# EAGLE design ft232 (EAGLE 7.4.0)
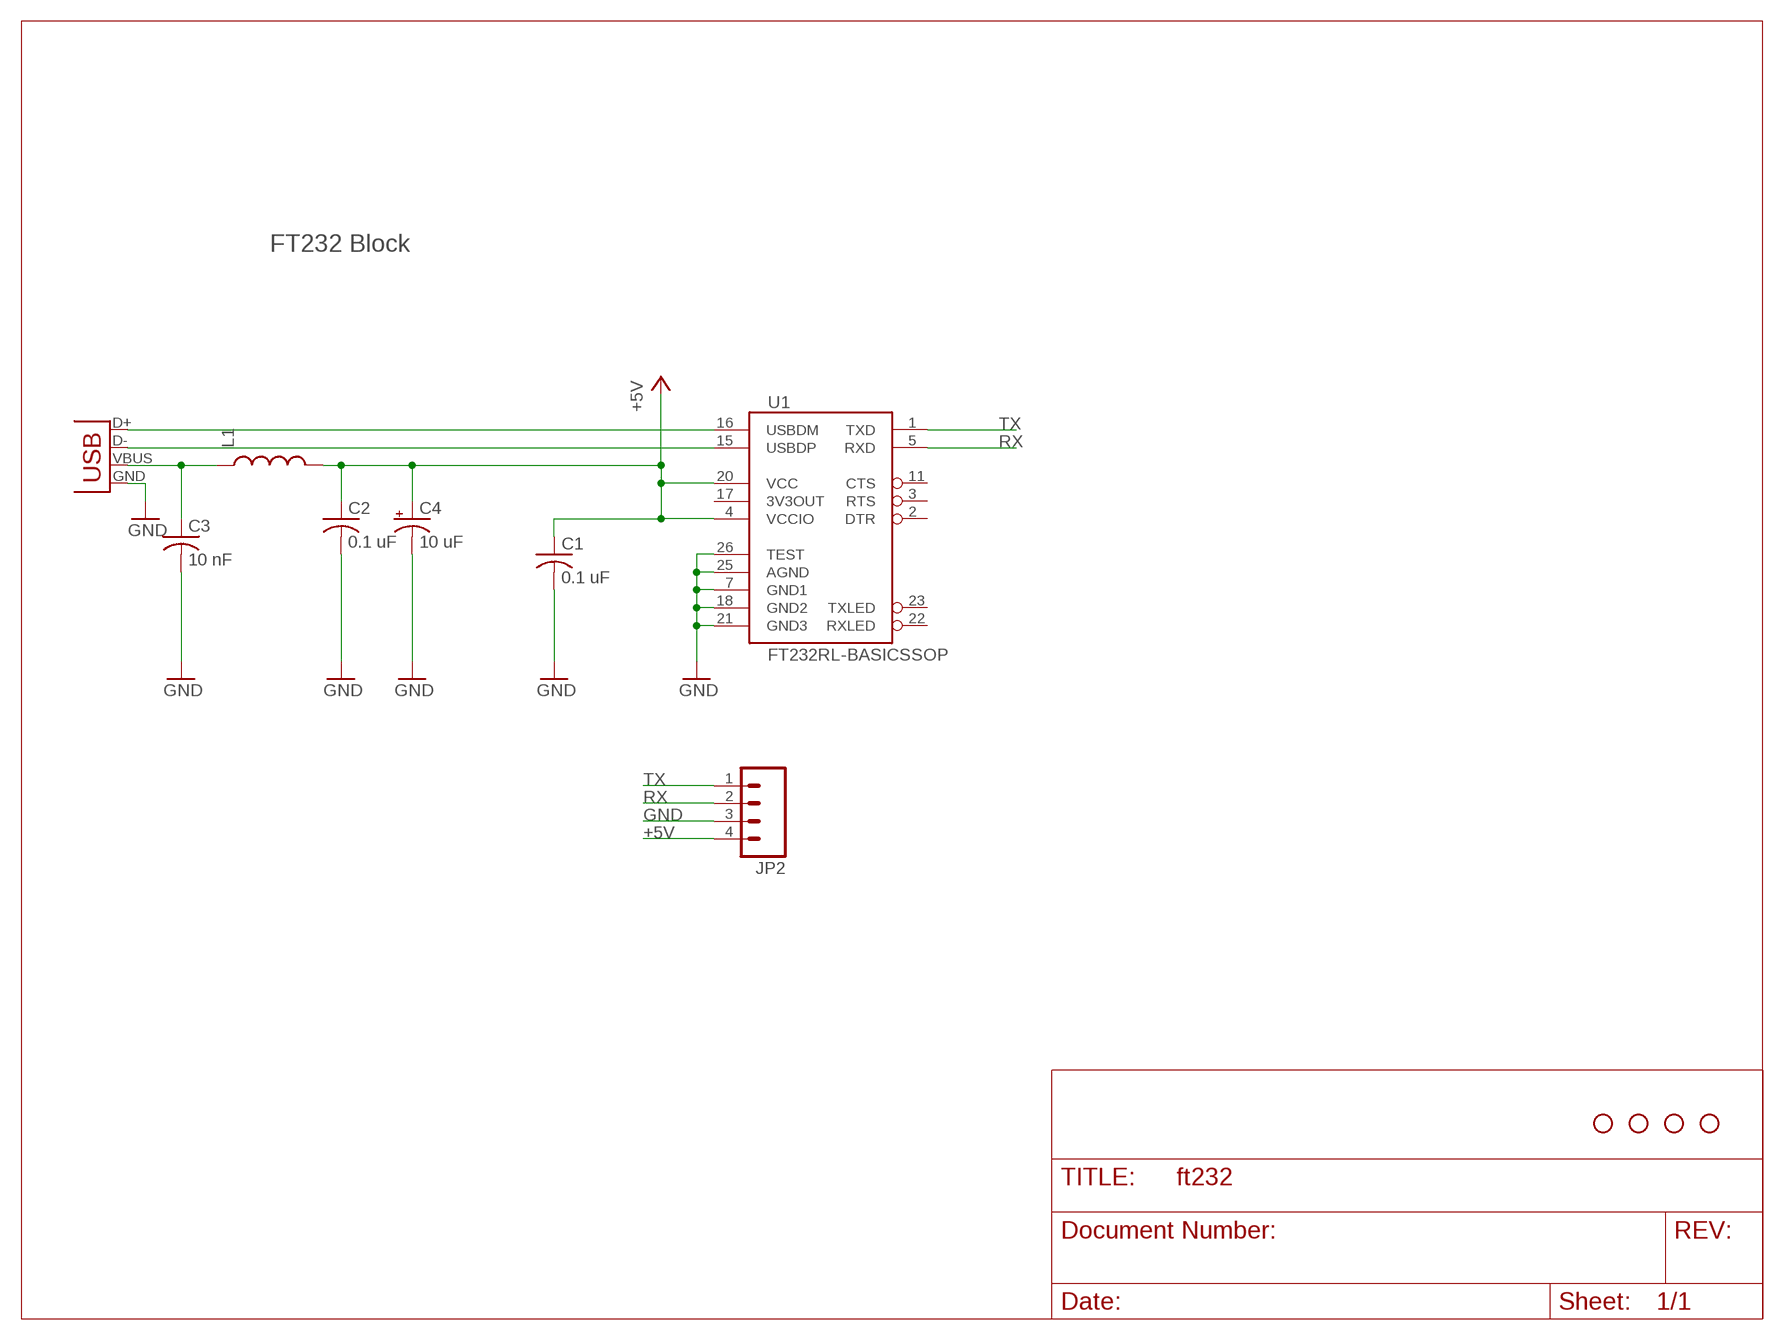
[diagram p0: schematic, sheet 1]

## Parts
C1  0.1 uF  C-USC0603  [C0603]
C2  0.1 uF  C-USC0603  [C0603]
C3  10 nF  C-USC0603  [C0603]
C4  10 uF  CAP_POL1206  [EIA3216]
JP1  USB-B  USBPTH  [USB-B-PTH]
JP2  M04PTH  [1X04]
L1  INDUCTOR0603  [0603]
STANDOFF1  STAND-OFF  [STAND-OFF]
STANDOFF2  STAND-OFF  [STAND-OFF]
STANDOFF3  STAND-OFF  [STAND-OFF]
STANDOFF4  STAND-OFF  [STAND-OFF]
U1  FT232RL-BASICSSOP  [SSOP28DB]

## Nets
+5V: C1.1 C2.1 C4.A(+) JP2.4 L1.2 U1.4(VCCIO) U1.20(VCC)
GND: C1.2 C2.2 C3.2 C4.C(-) JP1.GND JP2.3 U1.7(GND1) U1.18(GND2) U1.21(GND3) U1.25(AGND) U1.26(TEST)
N$1: C3.1 JP1.VBUS L1.1
N$3: JP1.D+ U1.16(USBDM)
N$4: JP1.D- U1.15(USBDP)
RX: JP2.2 U1.5(RXD)
TX: JP2.1 U1.1(TXD)
Unconnected: U1.2(DTR) U1.3(RTS) U1.11(CTS) U1.17(3V3OUT) U1.22(RXLED) U1.23(TXLED)

## Notes on the sheet
- FT232 Block

## Library data of the parts
C1-C3 = resistor:C-US: CAPACITOR, American symbol
C4 = SparkFun-Capacitors:CAP_POL: Capacitor Polarized These are standard SMD and PTH capacitors. Normally 10uF, 47uF, and 100uF in electrolytic and tantalum varieties. Always verify the external diameter of the through hole cap, it varies with capacity, voltage, and manufacturer. The EIA devices should be standard.
JP1 = SparkFun-Connectors:USB: USB Connectors USB-B-PTH is fully proven SKU : PRT-00139/CONN-08278 USB-miniB is fully proven SKU : PRT-00587 USB-A-PCB is untested. USB-A-H is throughly reviewed, but untested. Spark Fun Electronics SKU : PRT-00437 USB-B-SMT is throughly reviewed, but untested. Needs silkscreen touching up. USB-A-S has not been used/tested USB-MB-H has not been used/tested USB-MICROB has been used. CONN-09505; PROD_ID: CONN-08278
JP2 = SparkFun-Connectors:M04: Header 4 Standard 4-pin 0.1" header. Use with straight break away headers (SKU : PRT-00116), right angle break away headers (PRT-00553), swiss pins (PRT-00743), machine pins (PRT-00117), and female headers (PRT-00115). Molex polarized connector foot print use with SKU : PRT-08231 with associated crimp pins and housings. 1MM SMD Version SKU: PRT-10208
L1 = SparkFun-Passives:INDUCTOR: Inductors Basic Inductor/Choke - 0603 and 1206. Footprints are not proven and vary greatly between part numbers. SRN6045- 33uH, 20% 1.4A SDR0403-560KL - 56uH, 10%, 500mA RMS/740mA peak
STANDOFF1-STANDOFF4 = SparkFun-Electromechanical:STAND-OFF: #4 Stand Off This is the mechanical footprint for a #4 phillips button head screw. Use the keepout ring to avoid running the screw head into surrounding components. SKU : PRT-00447
U1 = SparkFun-DigitalIC:FT232RL-BASIC: USB UART This is the simplified version of the FT232RL unit. Only what you need, nothing you don't. Spark Fun Electronics SKU : COM-00650

## Board
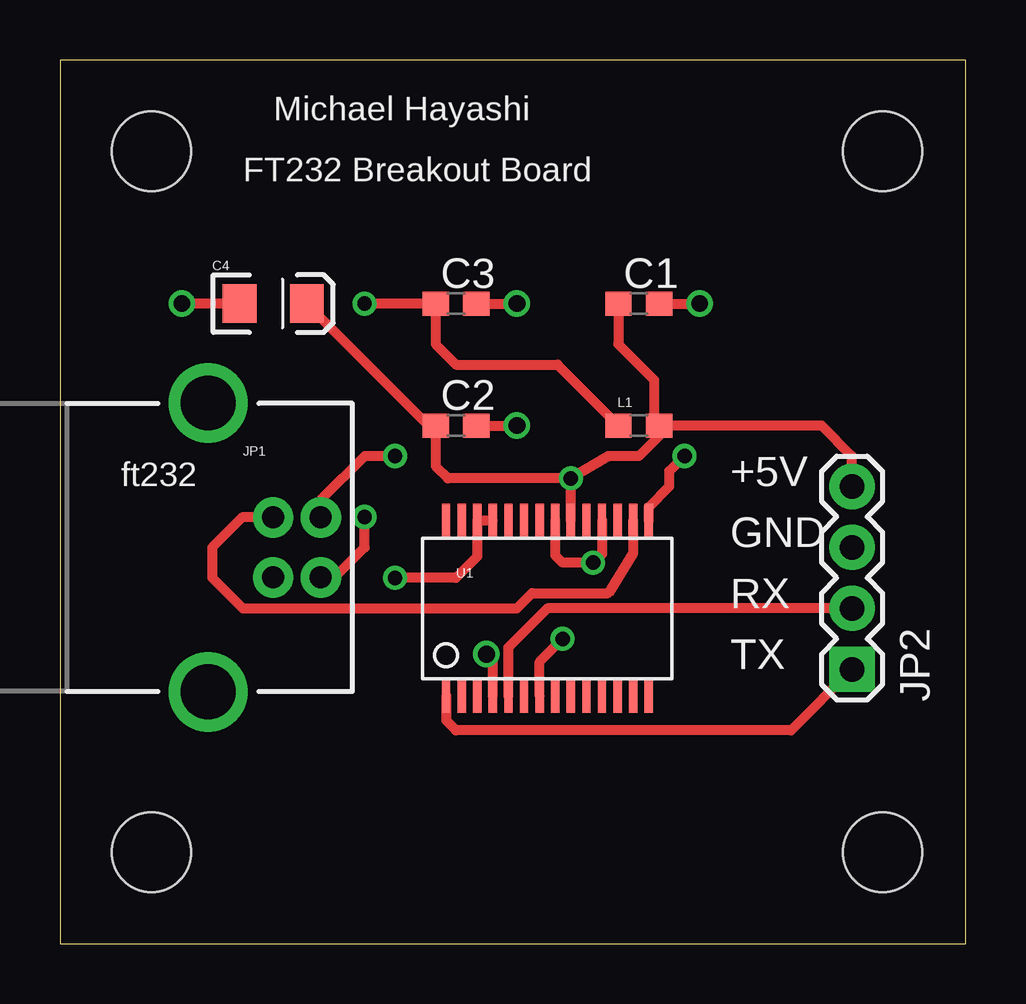
[diagram p1: board, top side]
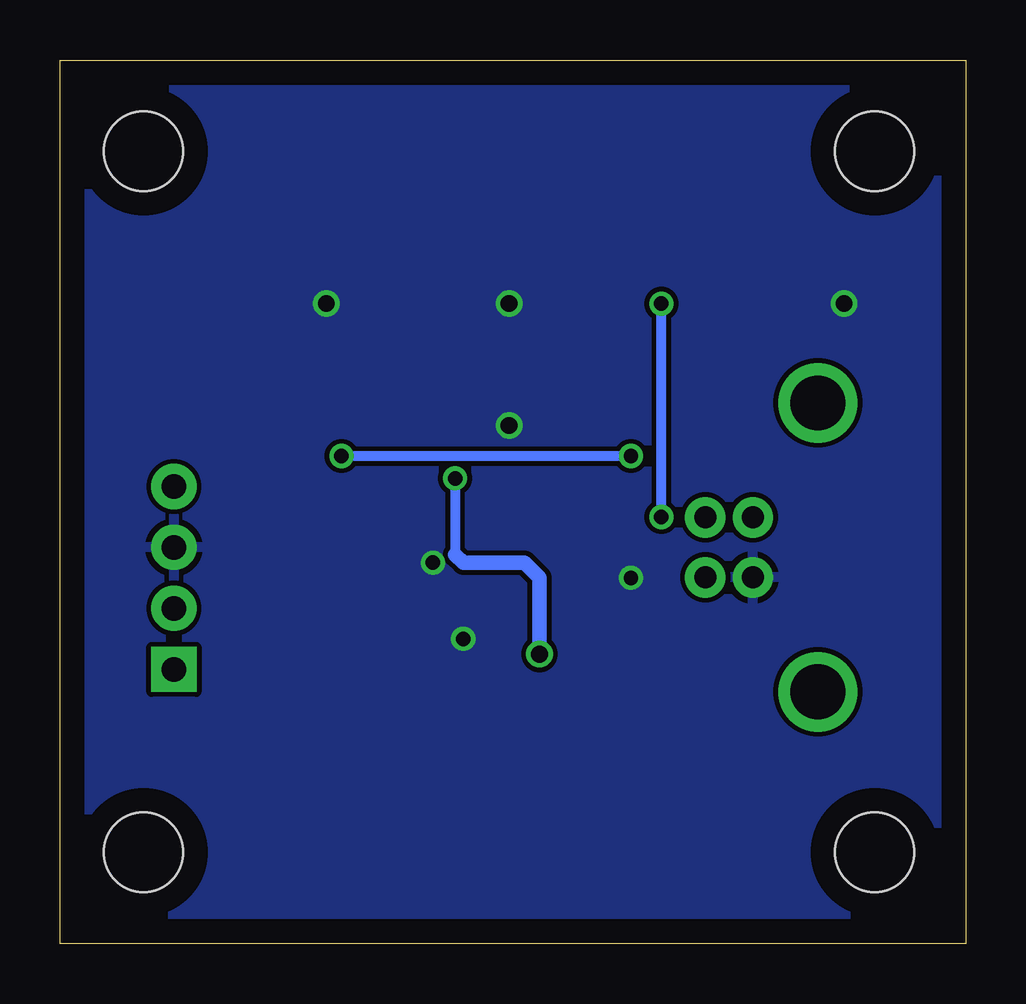
[diagram p2: board, bottom side, seen from below]

Size 37.77 x 36.82 mm. Coordinates in mm from the lower left corner, seen from the top.
Outline: 0,0 37.77,0 37.77,36.82 0,36.82 0,0
Copper layers (1*16): Top 0.035mm / dielectric 1.5mm / Bottom 0.035mm
Design rules "default": minimum track width 10mil, minimum drill 24mil, track to track 8mil, track to pad 8mil, pad to pad 8mil, via to via 8mil, smd to smd 8mil, copper to edge 40mil, drill to drill 8mil, minimum pad ring 10mil, minimum via ring 8mil, stop-mask expansion 4mil, vias tented up to drill 0mil, thermal gap 10mil

### Footprints (pad centres in the part's own frame; a part is rotated, then mirrored left to right if it is on the bottom)
C0603 = smd 1.1 x 1: 1 -0.85,0; 2 0.85,0
EIA3216 = smd 1.4 x 1.6: A 1.4,0; C -1.4,0
USB-B-PTH = drill 0.914 pad 1.676: D+ 0,1.25; D- 1.981,1.25; GND 0,-1.25; VBUS 1.981,-1.25 | drill 2.286: S1 -2.718,-6.02; S2 -2.718,6.02
1X04 = drill 1.016 pad 1.88 square: 1 0,0 | drill 1.016 pad 1.88: 2 2.54,0; 3 5.08,0; 4 7.62,0
0603 = smd 1.1 x 1: 1 -0.85,0; 2 0.85,0
STAND-OFF = hole 3.302: 0,0
SSOP28DB = smd 0.348 x 1.397: 1 -4.225,-3.656; 2 -3.575,-3.656; 3 -2.925,-3.656; 4 -2.275,-3.656; 5 -1.625,-3.656; 6 -0.975,-3.656; 7 -0.325,-3.656; 8 0.325,-3.656; 9 0.975,-3.656; 10 1.625,-3.656; 11 2.275,-3.656; 12 2.925,-3.656; 13 3.575,-3.656; 14 4.225,-3.656; 15 4.225,3.656; 16 3.575,3.656; 17 2.925,3.656; 18 2.275,3.656; 19 1.625,3.656; 20 0.975,3.656; 21 0.325,3.656; 22 -0.325,3.656; 23 -0.975,3.656; 24 -1.625,3.656; 25 -2.275,3.656; 26 -2.925,3.656; 27 -3.575,3.656; 28 -4.225,3.656

### Placement (x,y rotation side)
C1  24.13,26.67 0 top
C2  16.51,21.59 0 top
C3  16.51,26.67 0 top
C4  8.89,26.67 0 top
JP1  8.89,16.51 0 top
JP2  33.02,11.43 90 top
L1  24.13,21.59 0 top
STANDOFF1  3.81,33.02 0 top
STANDOFF2  3.81,3.81 0 top
STANDOFF3  34.29,33.02 0 top
STANDOFF4  34.29,3.81 0 top
U1  20.32,13.97 0 top

### Tracks (layer width: path | path; a pad name or v marks a point on that pad's centre or on a via)
+5V  (via drill 0.6 pad 0.61, 0.7)
  Top 0.406: JP2.4 33.02,20.32 31.75,21.59 L1.2 | C1.1 23.28,24.98 24.77,23.5 24.77,21.8 L1.2 | C4.A 15.37,21.59 C2.1 15.66,19.9 16.17,19.39 v21.3,19.39 | U1.4 18.05,11.8 v17.78,12.06 | L1.2 24.98,21.17 24.13,20.32 22.86,20.32 v21.3,19.39 | U1.20 v21.3,19.39
  Bottom 0.406: v21.3,19.39 21.3,16.21
  Bottom 0.61: v17.78,12.06 17.78,15.24 18.41,15.88 20.95,15.88 21.3,16.21
GND  (via drill 0.6 pad 0.61, 0.7 pad 0.81)
  Top 0.406: C4.C v5.08,26.67 | C3.2 v19.05,26.67 | C2.2 v19.05,21.59 | C1.2 v26.67,26.67 | U1.7 20,11.74 v20.95,12.7 | v13.97,15.24 16.51,15.24 17.39,16.12 U1.26 U1.25 | U1.18 22.59,16.25 v22.23,15.88 20.95,15.88 20.64,16.18 U1.21
  pour Bottom: 0,36.83 38.1,36.83 38.1,0 0,0
N$1  (via drill 0.6)
  Top 0.406: L1.1 20.74,24.13 16.51,24.13 15.66,24.98 C3.1 v12.7,26.67 | JP1.VBUS 11.45,15.26 12.7,16.51 v12.7,17.78
  Bottom 0.406: v12.7,17.78 v12.7,26.67
N$3
  Top 0.406: JP1.D+ 7.6,17.76 6.35,16.51 6.35,15.24 7.62,13.97 19.05,13.97 19.68,14.61 22.86,14.61 23.89,16.27 U1.16
N$4  (via drill 0.6 pad 0.61)
  Top 0.406: JP1.D- 10.87,18.49 12.7,20.32 v13.97,20.32 | U1.15 24.55,18.2 25.4,19.05 25.4,19.68 v26.04,20.32
  Bottom 0.406: v13.97,20.32 v26.04,20.32
RX
  Top 0.406: JP2.2 20.32,13.97 18.7,12.35 U1.5
TX
  Top 0.406: JP2.1 30.48,8.89 16.51,8.89 16.09,9.3 U1.1

### Text on the board
tPlace: Michael Hayashi | FT232 Breakout Board | +5V | GND | RX | TX